# EasyEDA schematic mini_water_station_2020-11-22_21-22-46.json
TITLE: Sheet_1; REV: 1.0; Date: 2020-11-15; Sheet: 1/1; Drawn By: Przemysław Szyszkiewicz; Company: Your Company
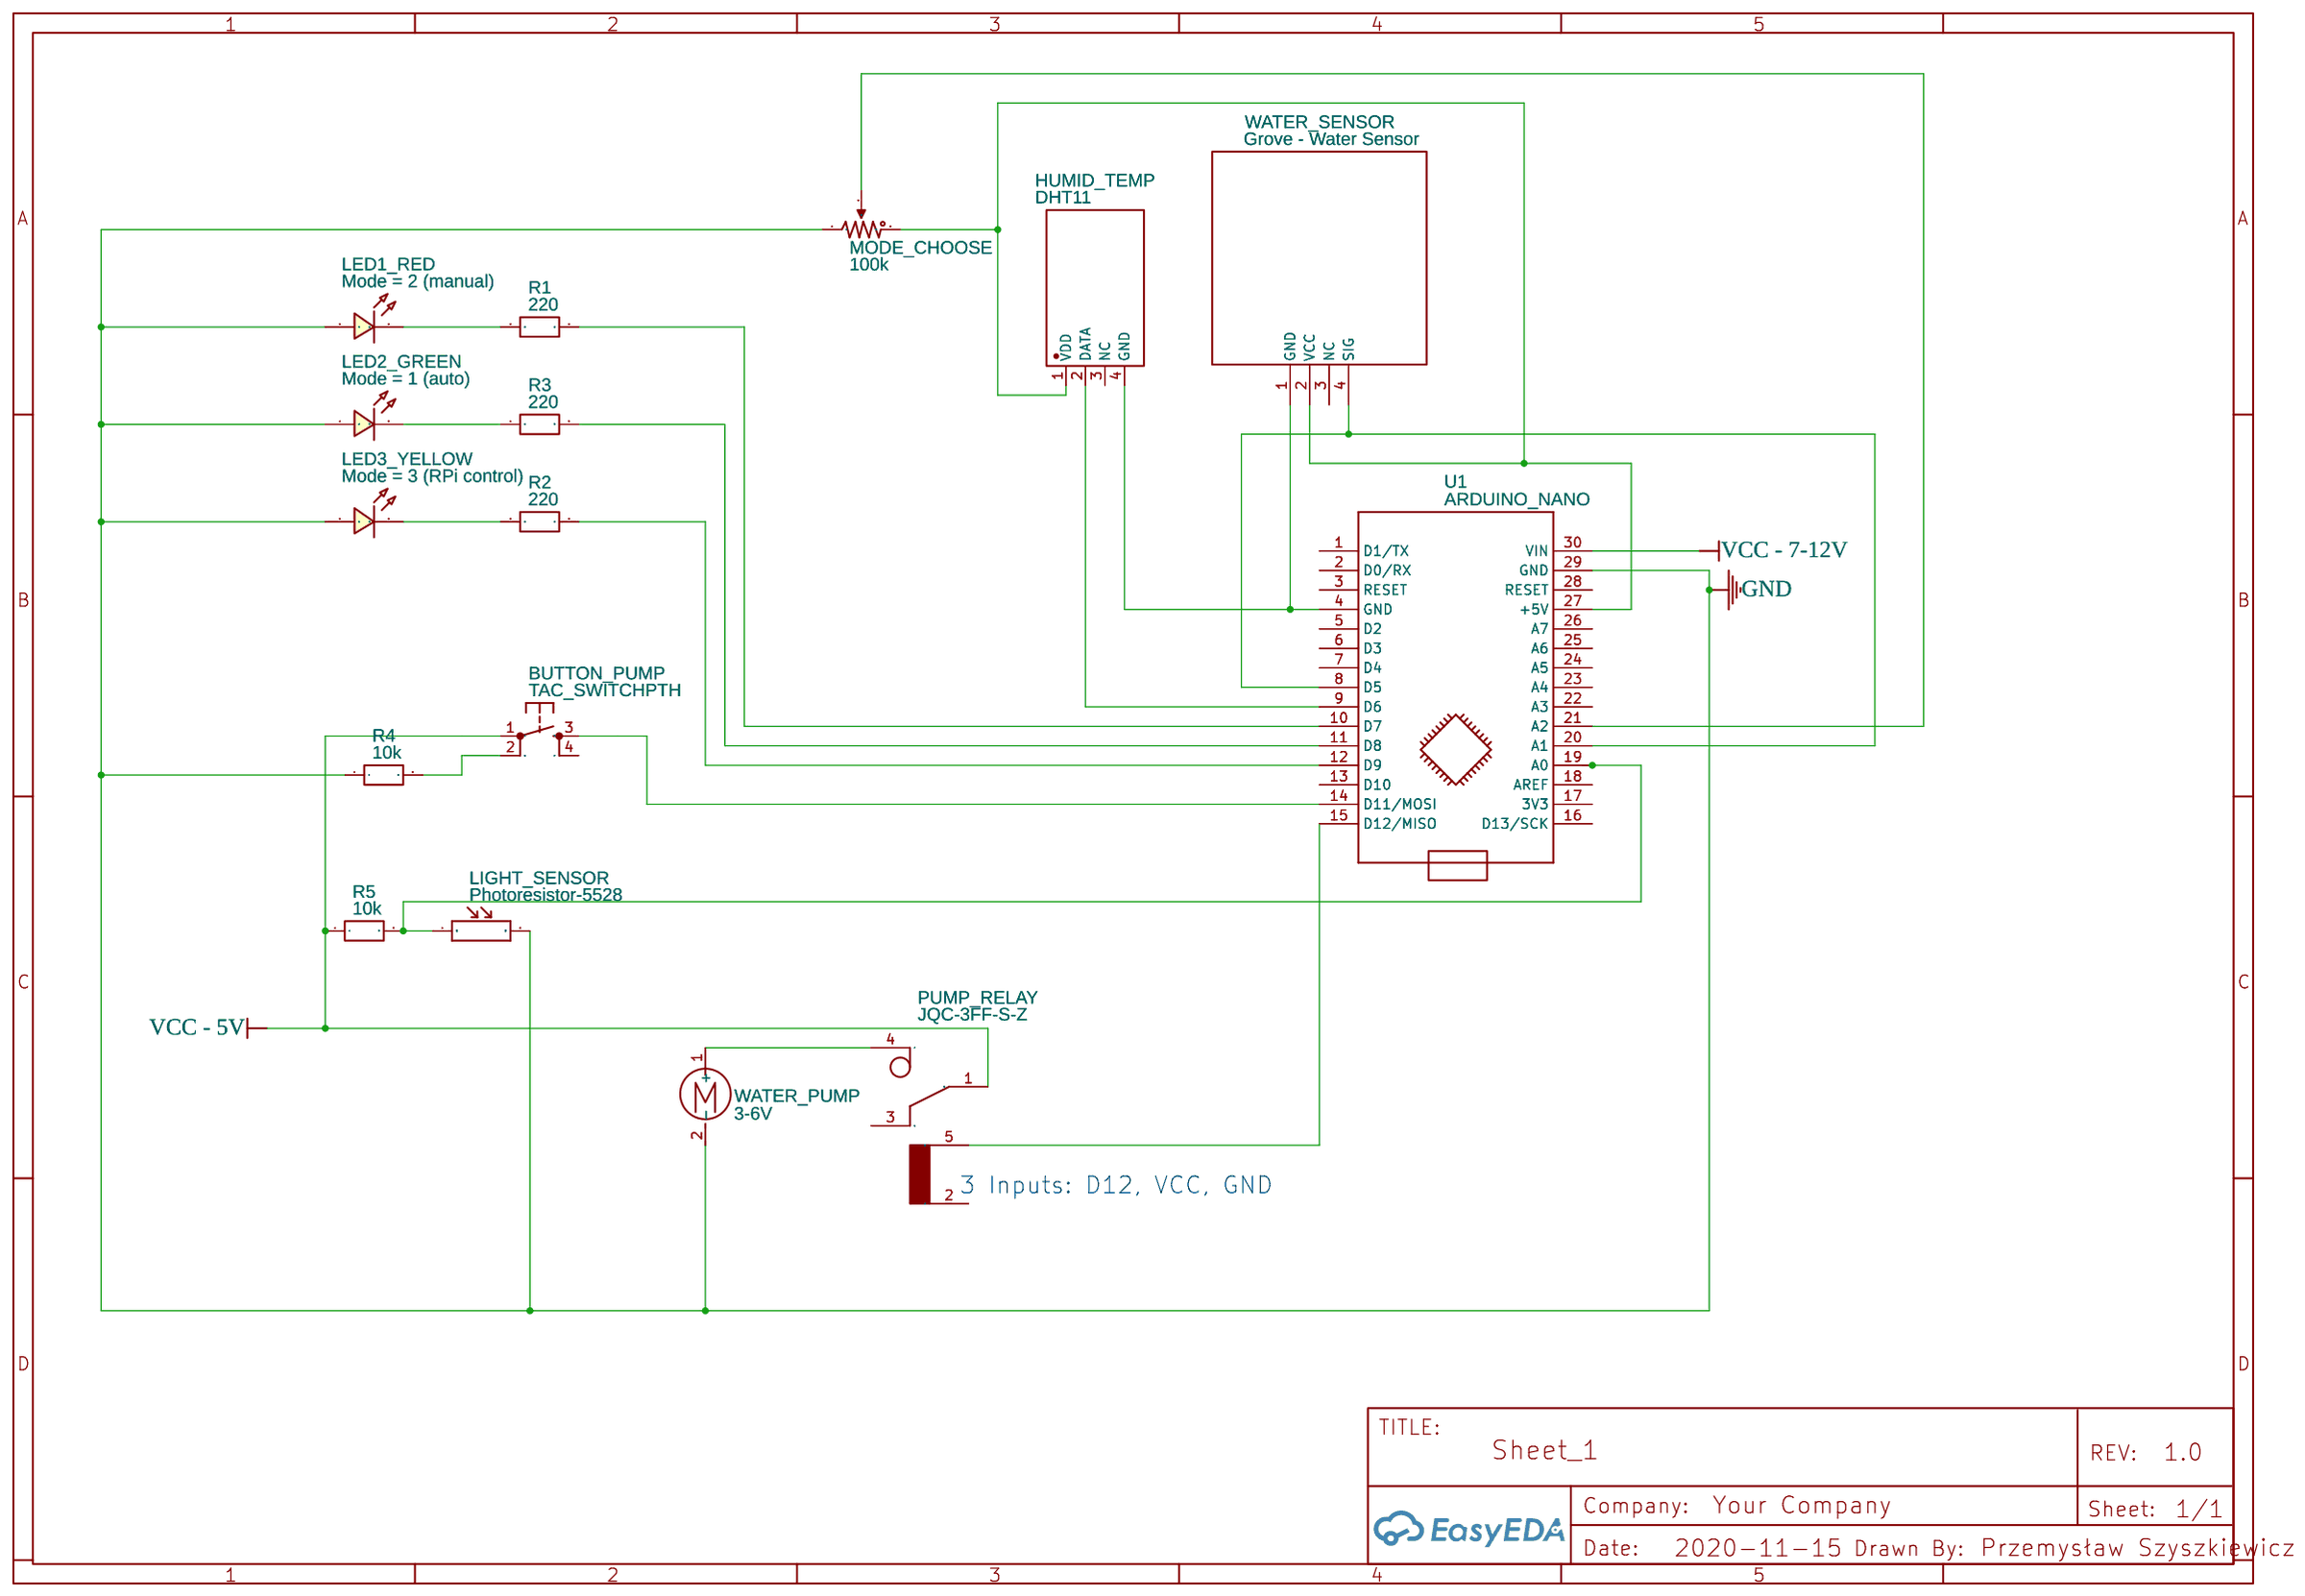
[diagram p0: schematic sheet]

## Parts
BUTTON_PUMP  TAC_SWITCHPTH  [TACTILE-PTH]
HUMID_TEMP  DHT11  [DHT11]
LED1_RED  Mode = 2 (manual)  [LED0603_RED]
LED2_GREEN  Mode = 1 (auto)  [LED0603_GREEN]
LED3_YELLOW  Mode = 3 (RPi control)  [LED0603_BLUE]
LIGHT_SENSOR  Photoresistor-5528  [SNR2-3.0]
MODE_CHOOSE  100k  [RES-ADJ_3296W]
PUMP_RELAY  JQC-3FF-S-Z  [JQC-3FF-S-Z]
R1  220  [R0603]
R2  220  [R0603]
R3  220  [R0603]
R4  10k  [R0603]
R5  10k  [R0603]
U1  ARDUINO_NANO  [ARDUINO_NANO]
WATER_PUMP  3-6V  [CONN-TH_2P-P5.08]
WATER_SENSOR  Grove - Water Sensor  [GROVE - WATER SENSOR]

## Library data of the parts
BUTTON_PUMP = TAC_SWITCHPTH: Momentary Switch; Contributor: SparkFun
HUMID_TEMP = DHT11: Supplier: LCSC; Supplier Part: C117051; Manufacturer: Aosong (Guangzhou) Elec; Contributor: LCSC
LED1_RED = LED-0603_R: Manufacturer: EVERLIGHT(台湾亿光); Manufacturer Part: 19-217/R6C-AL1M2VY/3T; Supplier Part: C72044; Supplier: LCSC; Contributor: LCEDA_01
LED2_GREEN = LED-0603_G: Manufacturer: EVERLIGHT(台湾亿光); Manufacturer Part: 19-217/GHC-YR1S2/3T; Supplier Part: C72043; Supplier: LCSC; Contributor: LCEDA_Lib
LED3_YELLOW = LED-0603_B: Manufacturer: EVERLIGHT(台湾亿光); Manufacturer Part: 19-217/BHC-ZL1M2RY/3T; Supplier Part: C72041; Supplier: LCSC; Contributor: LCEDA_01
LIGHT_SENSOR = Photoresistor-5528: DIP RES Photoresistor 10K;2P-3.0
MODE_CHOOSE = Potentiometer: K(%): 50
PUMP_RELAY = JQC-3FF-S-Z: Contributor: EasyEDA; link: https://www.alibaba.com/product-detail/relay-types-JQC-3FF-S-Z_60682592473.html
R1-R5 = R_0603_EU: Contributor: LCEDA_Lib
U1 = ARDUINO_NANO: sourceId: KGSeAWhDB
WATER_PUMP = Motor_DC: Contributor: KiCAD; license: https://www.gnu.org/licenses/lgpl-2.1.html
WATER_SENSOR = Grove - Water Sensor: sourceId: PCwqI0iAu; Supplier Part: undefined; Supplier: SeeedStudio

## Nets
GND: LED1_RED.1 LED2_GREEN.1 LED3_YELLOW.1 LIGHT_SENSOR.2(P$2) MODE_CHOOSE.1 R4.1 U1.29(GND) WATER_PUMP.2(-)
VCC - 5V: BUTTON_PUMP.1 PUMP_RELAY.1 R5.1
VCC - 7-12V: U1.30(VIN)
Net-(BUTTON_PUMP-2): BUTTON_PUMP.2 R4.2
Net-(BUTTON_PUMP-3): BUTTON_PUMP.3 U1.14(D11/MOSI)
Net-(HUMID_TEMP-1): HUMID_TEMP.1(VDD) MODE_CHOOSE.3(2) U1.27(+5V) WATER_SENSOR.2(VCC)
Net-(HUMID_TEMP-2): HUMID_TEMP.2(DATA) U1.9(D6)
Net-(HUMID_TEMP-4): HUMID_TEMP.4(GND) U1.4(GND) WATER_SENSOR.1(GND)
Net-(LED1_RED-2): LED1_RED.2 R1.1
Net-(LED2_GREEN-2): LED2_GREEN.2 R3.1
Net-(LED3_YELLOW-2): LED3_YELLOW.2 R2.1
Net-(LIGHT_SENSOR-1): LIGHT_SENSOR.1(P$1) R5.2 U1.19(A0)
Net-(MODE_CHOOSE-2): MODE_CHOOSE.2(3) U1.21(A2)
Net-(PUMP_RELAY-4): PUMP_RELAY.4 WATER_PUMP.1(+)
Net-(PUMP_RELAY-5): PUMP_RELAY.5 U1.15(D12/MISO)
Net-(R1-2): R1.2 U1.10(D7)
Net-(R2-2): R2.2 U1.12(D9)
Net-(R3-2): R3.2 U1.11(D8)
Net-(U1-8): U1.8(D5) U1.20(A1) WATER_SENSOR.4(SIG)

Not connected (* = marked no-connect by the designer): BUTTON_PUMP 4; HUMID_TEMP 3(NC); PUMP_RELAY 2 3; U1 1(D1/TX) 2(D0/RX) 3(RESET) 5(D2) 6(D3) 7(D4) 13(D10) 16(D13/SCK) 17(3V3) 18(AREF) 22(A3) 23(A4) 24(A5) 25(A6) 26(A7) 28(RESET); WATER_SENSOR 3(NC)

## Notes on the sheet
- 3 Inputs: D12, VCC, GND
